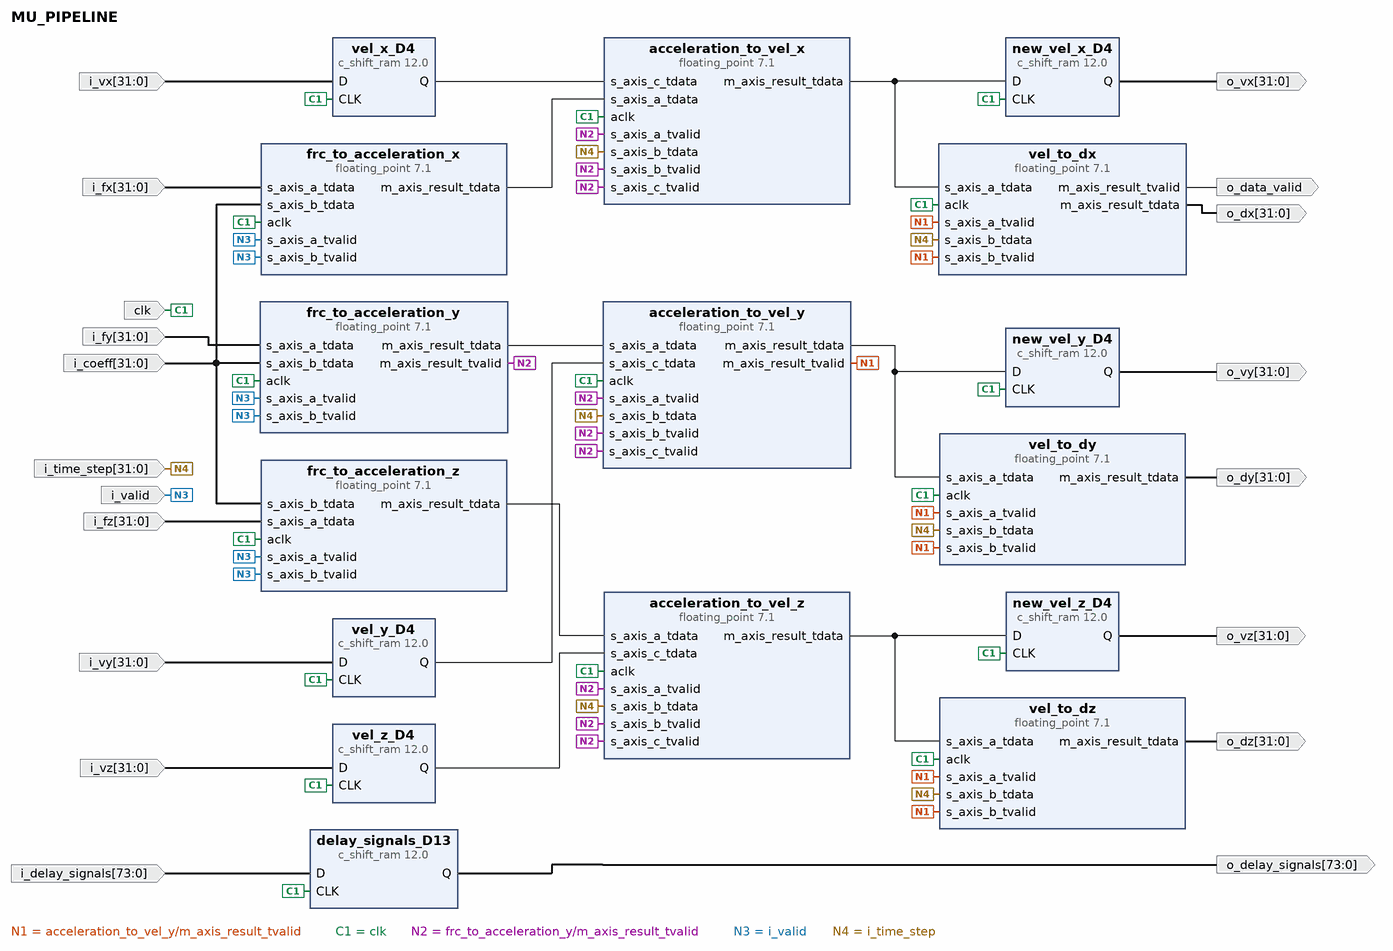
[diagram p0: block diagram of the top level]
# Vivado block design MU_PIPELINE, xcu280-fsvh2892-2L-e, Vivado 2021.2
create_bd_design MU_PIPELINE

create_bd_port -dir I -type clk clk
set_property -dict {CONFIG.FREQ_HZ 10000000} [get_bd_ports clk]
create_bd_port -dir I -from 31 -to 0 i_coeff
create_bd_port -dir I -from 73 -to 0 -type data i_delay_signals
create_bd_port -dir I -from 31 -to 0 i_fx
create_bd_port -dir I -from 31 -to 0 i_fy
create_bd_port -dir I -from 31 -to 0 i_fz
create_bd_port -dir I -from 31 -to 0 i_time_step
create_bd_port -dir I i_valid
create_bd_port -dir I -from 31 -to 0 -type data i_vx
create_bd_port -dir I -from 31 -to 0 -type data i_vy
create_bd_port -dir I -from 31 -to 0 -type data i_vz
create_bd_port -dir O o_data_valid
create_bd_port -dir O -from 73 -to 0 -type data o_delay_signals
create_bd_port -dir O -from 31 -to 0 o_dx
create_bd_port -dir O -from 31 -to 0 o_dy
create_bd_port -dir O -from 31 -to 0 o_dz
create_bd_port -dir O -from 31 -to 0 -type data o_vx
create_bd_port -dir O -from 31 -to 0 -type data o_vy
create_bd_port -dir O -from 31 -to 0 -type data o_vz

create_bd_cell -type ip -vlnv xilinx.com:ip:floating_point:7.1 acceleration_to_vel_x
set_property -dict [list \
  CONFIG.Add_Sub_Value Add \
  CONFIG.C_Latency 5 \
  CONFIG.C_Mult_Usage Medium_Usage \
  CONFIG.C_Rate 1 \
  CONFIG.C_Result_Exponent_Width 8 \
  CONFIG.C_Result_Fraction_Width 24 \
  CONFIG.Flow_Control NonBlocking \
  CONFIG.Has_RESULT_TREADY false \
  CONFIG.Maximum_Latency false \
  CONFIG.Operation_Type FMA \
  CONFIG.Result_Precision_Type Single \
] [get_bd_cells acceleration_to_vel_x]
create_bd_cell -type ip -vlnv xilinx.com:ip:floating_point:7.1 acceleration_to_vel_y
set_property -dict [list \
  CONFIG.Add_Sub_Value Add \
  CONFIG.C_Latency 5 \
  CONFIG.C_Mult_Usage Medium_Usage \
  CONFIG.C_Rate 1 \
  CONFIG.C_Result_Exponent_Width 8 \
  CONFIG.C_Result_Fraction_Width 24 \
  CONFIG.Flow_Control NonBlocking \
  CONFIG.Has_RESULT_TREADY false \
  CONFIG.Maximum_Latency false \
  CONFIG.Operation_Type FMA \
  CONFIG.Result_Precision_Type Single \
] [get_bd_cells acceleration_to_vel_y]
create_bd_cell -type ip -vlnv xilinx.com:ip:floating_point:7.1 acceleration_to_vel_z
set_property -dict [list \
  CONFIG.Add_Sub_Value Add \
  CONFIG.C_Latency 5 \
  CONFIG.C_Mult_Usage Medium_Usage \
  CONFIG.C_Rate 1 \
  CONFIG.C_Result_Exponent_Width 8 \
  CONFIG.C_Result_Fraction_Width 24 \
  CONFIG.Flow_Control NonBlocking \
  CONFIG.Has_RESULT_TREADY false \
  CONFIG.Maximum_Latency false \
  CONFIG.Operation_Type FMA \
  CONFIG.Result_Precision_Type Single \
] [get_bd_cells acceleration_to_vel_z]
create_bd_cell -type ip -vlnv xilinx.com:ip:c_shift_ram:12.0 delay_signals_D13
set_property -dict [list \
  CONFIG.AsyncInitVal 00000000000000000000000000000000000000000000000000000000000000000000000000 \
  CONFIG.DefaultData 00000000000000000000000000000000000000000000000000000000000000000000000000 \
  CONFIG.Depth 13 \
  CONFIG.Width 74 \
] [get_bd_cells delay_signals_D13]
create_bd_cell -type ip -vlnv xilinx.com:ip:floating_point:7.1 frc_to_acceleration_x
set_property -dict [list \
  CONFIG.C_Latency 4 \
  CONFIG.C_Mult_Usage Full_Usage \
  CONFIG.C_Rate 1 \
  CONFIG.C_Result_Exponent_Width 8 \
  CONFIG.C_Result_Fraction_Width 24 \
  CONFIG.Flow_Control NonBlocking \
  CONFIG.Has_RESULT_TREADY false \
  CONFIG.Maximum_Latency false \
  CONFIG.Operation_Type Multiply \
  CONFIG.Result_Precision_Type Single \
] [get_bd_cells frc_to_acceleration_x]
create_bd_cell -type ip -vlnv xilinx.com:ip:floating_point:7.1 frc_to_acceleration_y
set_property -dict [list \
  CONFIG.C_Latency 4 \
  CONFIG.C_Mult_Usage Full_Usage \
  CONFIG.C_Rate 1 \
  CONFIG.C_Result_Exponent_Width 8 \
  CONFIG.C_Result_Fraction_Width 24 \
  CONFIG.Flow_Control NonBlocking \
  CONFIG.Has_RESULT_TREADY false \
  CONFIG.Maximum_Latency false \
  CONFIG.Operation_Type Multiply \
  CONFIG.Result_Precision_Type Single \
] [get_bd_cells frc_to_acceleration_y]
create_bd_cell -type ip -vlnv xilinx.com:ip:floating_point:7.1 frc_to_acceleration_z
set_property -dict [list \
  CONFIG.C_Latency 4 \
  CONFIG.C_Mult_Usage Full_Usage \
  CONFIG.C_Rate 1 \
  CONFIG.C_Result_Exponent_Width 8 \
  CONFIG.C_Result_Fraction_Width 24 \
  CONFIG.Flow_Control NonBlocking \
  CONFIG.Has_RESULT_TREADY false \
  CONFIG.Maximum_Latency false \
  CONFIG.Operation_Type Multiply \
  CONFIG.Result_Precision_Type Single \
] [get_bd_cells frc_to_acceleration_z]
create_bd_cell -type ip -vlnv xilinx.com:ip:c_shift_ram:12.0 new_vel_x_D4
set_property -dict {CONFIG.Depth 4 CONFIG.Width 32} [get_bd_cells new_vel_x_D4]
create_bd_cell -type ip -vlnv xilinx.com:ip:c_shift_ram:12.0 new_vel_y_D4
set_property -dict {CONFIG.Depth 4 CONFIG.Width 32} [get_bd_cells new_vel_y_D4]
create_bd_cell -type ip -vlnv xilinx.com:ip:c_shift_ram:12.0 new_vel_z_D4
set_property -dict {CONFIG.Depth 4 CONFIG.Width 32} [get_bd_cells new_vel_z_D4]
create_bd_cell -type ip -vlnv xilinx.com:ip:floating_point:7.1 vel_to_dx
set_property -dict [list \
  CONFIG.Add_Sub_Value Both \
  CONFIG.C_Latency 4 \
  CONFIG.C_Mult_Usage Medium_Usage \
  CONFIG.C_Rate 1 \
  CONFIG.C_Result_Exponent_Width 8 \
  CONFIG.C_Result_Fraction_Width 24 \
  CONFIG.Flow_Control NonBlocking \
  CONFIG.Has_RESULT_TREADY false \
  CONFIG.Maximum_Latency false \
  CONFIG.Operation_Type Multiply \
  CONFIG.Result_Precision_Type Single \
] [get_bd_cells vel_to_dx]
create_bd_cell -type ip -vlnv xilinx.com:ip:floating_point:7.1 vel_to_dy
set_property -dict [list \
  CONFIG.Add_Sub_Value Both \
  CONFIG.C_Latency 4 \
  CONFIG.C_Mult_Usage Medium_Usage \
  CONFIG.C_Rate 1 \
  CONFIG.C_Result_Exponent_Width 8 \
  CONFIG.C_Result_Fraction_Width 24 \
  CONFIG.Flow_Control NonBlocking \
  CONFIG.Has_RESULT_TREADY false \
  CONFIG.Maximum_Latency false \
  CONFIG.Operation_Type Multiply \
  CONFIG.Result_Precision_Type Single \
] [get_bd_cells vel_to_dy]
create_bd_cell -type ip -vlnv xilinx.com:ip:floating_point:7.1 vel_to_dz
set_property -dict [list \
  CONFIG.Add_Sub_Value Both \
  CONFIG.C_Latency 4 \
  CONFIG.C_Mult_Usage Medium_Usage \
  CONFIG.C_Rate 1 \
  CONFIG.C_Result_Exponent_Width 8 \
  CONFIG.C_Result_Fraction_Width 24 \
  CONFIG.Flow_Control NonBlocking \
  CONFIG.Has_RESULT_TREADY false \
  CONFIG.Maximum_Latency false \
  CONFIG.Operation_Type Multiply \
  CONFIG.Result_Precision_Type Single \
] [get_bd_cells vel_to_dz]
create_bd_cell -type ip -vlnv xilinx.com:ip:c_shift_ram:12.0 vel_x_D4
set_property -dict {CONFIG.Depth 4 CONFIG.Width 32} [get_bd_cells vel_x_D4]
create_bd_cell -type ip -vlnv xilinx.com:ip:c_shift_ram:12.0 vel_y_D4
set_property -dict {CONFIG.Depth 4 CONFIG.Width 32} [get_bd_cells vel_y_D4]
create_bd_cell -type ip -vlnv xilinx.com:ip:c_shift_ram:12.0 vel_z_D4
set_property -dict {CONFIG.Depth 4 CONFIG.Width 32} [get_bd_cells vel_z_D4]

# ---- connections ----

connect_bd_net -net D_0_1 [get_bd_ports i_vx] [get_bd_pins vel_x_D4/D]
connect_bd_net -net D_0_2 [get_bd_ports i_delay_signals] [get_bd_pins delay_signals_D13/D]
connect_bd_net -net D_1_1 [get_bd_ports i_vz] [get_bd_pins vel_z_D4/D]
connect_bd_net -net D_2_1 [get_bd_ports i_vy] [get_bd_pins vel_y_D4/D]
connect_bd_net [get_bd_pins acceleration_to_vel_x/m_axis_result_tdata] [get_bd_pins new_vel_x_D4/D] [get_bd_pins vel_to_dx/s_axis_a_tdata]
connect_bd_net [get_bd_pins acceleration_to_vel_y/m_axis_result_tdata] [get_bd_pins new_vel_y_D4/D] [get_bd_pins vel_to_dy/s_axis_a_tdata]
connect_bd_net [get_bd_pins acceleration_to_vel_y/m_axis_result_tvalid] \
  [get_bd_pins vel_to_dx/s_axis_a_tvalid] [get_bd_pins vel_to_dx/s_axis_b_tvalid] [get_bd_pins vel_to_dy/s_axis_a_tvalid] \
  [get_bd_pins vel_to_dy/s_axis_b_tvalid] [get_bd_pins vel_to_dz/s_axis_a_tvalid] [get_bd_pins vel_to_dz/s_axis_b_tvalid]
connect_bd_net [get_bd_pins acceleration_to_vel_z/m_axis_result_tdata] [get_bd_pins new_vel_z_D4/D] [get_bd_pins vel_to_dz/s_axis_a_tdata]
connect_bd_net -net aclk_0_1 [get_bd_ports clk] \
  [get_bd_pins acceleration_to_vel_x/aclk] [get_bd_pins acceleration_to_vel_y/aclk] [get_bd_pins acceleration_to_vel_z/aclk] \
  [get_bd_pins delay_signals_D13/CLK] [get_bd_pins frc_to_acceleration_x/aclk] [get_bd_pins frc_to_acceleration_y/aclk] \
  [get_bd_pins frc_to_acceleration_z/aclk] [get_bd_pins new_vel_x_D4/CLK] [get_bd_pins new_vel_y_D4/CLK] \
  [get_bd_pins new_vel_z_D4/CLK] [get_bd_pins vel_to_dx/aclk] [get_bd_pins vel_to_dy/aclk] [get_bd_pins vel_to_dz/aclk] \
  [get_bd_pins vel_x_D4/CLK] [get_bd_pins vel_y_D4/CLK] [get_bd_pins vel_z_D4/CLK]
connect_bd_net [get_bd_pins delay_signals_D13/Q] [get_bd_ports o_delay_signals]
connect_bd_net [get_bd_pins frc_to_acceleration_x/m_axis_result_tdata] [get_bd_pins acceleration_to_vel_x/s_axis_a_tdata]
connect_bd_net [get_bd_pins frc_to_acceleration_y/m_axis_result_tdata] [get_bd_pins acceleration_to_vel_y/s_axis_a_tdata]
connect_bd_net [get_bd_pins frc_to_acceleration_y/m_axis_result_tvalid] \
  [get_bd_pins acceleration_to_vel_x/s_axis_a_tvalid] [get_bd_pins acceleration_to_vel_x/s_axis_b_tvalid] \
  [get_bd_pins acceleration_to_vel_x/s_axis_c_tvalid] [get_bd_pins acceleration_to_vel_y/s_axis_a_tvalid] \
  [get_bd_pins acceleration_to_vel_y/s_axis_b_tvalid] [get_bd_pins acceleration_to_vel_y/s_axis_c_tvalid] \
  [get_bd_pins acceleration_to_vel_z/s_axis_a_tvalid] [get_bd_pins acceleration_to_vel_z/s_axis_b_tvalid] \
  [get_bd_pins acceleration_to_vel_z/s_axis_c_tvalid]
connect_bd_net [get_bd_pins frc_to_acceleration_z/m_axis_result_tdata] [get_bd_pins acceleration_to_vel_z/s_axis_a_tdata]
connect_bd_net [get_bd_pins new_vel_x_D4/Q] [get_bd_ports o_vx]
connect_bd_net [get_bd_pins new_vel_y_D4/Q] [get_bd_ports o_vy]
connect_bd_net [get_bd_pins new_vel_z_D4/Q] [get_bd_ports o_vz]
connect_bd_net -net s_axis_a_tdata_0_1 [get_bd_ports i_fz] [get_bd_pins frc_to_acceleration_z/s_axis_a_tdata]
connect_bd_net -net s_axis_a_tdata_1_1 [get_bd_ports i_fy] [get_bd_pins frc_to_acceleration_y/s_axis_a_tdata]
connect_bd_net -net s_axis_a_tdata_2_1 [get_bd_ports i_fx] [get_bd_pins frc_to_acceleration_x/s_axis_a_tdata]
connect_bd_net -net s_axis_a_tvalid_0_1 [get_bd_ports i_valid] \
  [get_bd_pins frc_to_acceleration_x/s_axis_a_tvalid] [get_bd_pins frc_to_acceleration_x/s_axis_b_tvalid] \
  [get_bd_pins frc_to_acceleration_y/s_axis_a_tvalid] [get_bd_pins frc_to_acceleration_y/s_axis_b_tvalid] \
  [get_bd_pins frc_to_acceleration_z/s_axis_a_tvalid] [get_bd_pins frc_to_acceleration_z/s_axis_b_tvalid]
connect_bd_net -net s_axis_b_tdata_0_1 [get_bd_ports i_time_step] \
  [get_bd_pins acceleration_to_vel_x/s_axis_b_tdata] [get_bd_pins acceleration_to_vel_y/s_axis_b_tdata] \
  [get_bd_pins acceleration_to_vel_z/s_axis_b_tdata] [get_bd_pins vel_to_dx/s_axis_b_tdata] \
  [get_bd_pins vel_to_dy/s_axis_b_tdata] [get_bd_pins vel_to_dz/s_axis_b_tdata]
connect_bd_net -net s_axis_b_tdata_1_1 [get_bd_ports i_coeff] \
  [get_bd_pins frc_to_acceleration_x/s_axis_b_tdata] [get_bd_pins frc_to_acceleration_y/s_axis_b_tdata] \
  [get_bd_pins frc_to_acceleration_z/s_axis_b_tdata]
connect_bd_net -net vel_to_pos_x_m_axis_result_tdata [get_bd_pins vel_to_dx/m_axis_result_tdata] [get_bd_ports o_dx]
connect_bd_net -net vel_to_pos_x_m_axis_result_tvalid [get_bd_pins vel_to_dx/m_axis_result_tvalid] [get_bd_ports o_data_valid]
connect_bd_net -net vel_to_pos_y_m_axis_result_tdata [get_bd_pins vel_to_dy/m_axis_result_tdata] [get_bd_ports o_dy]
connect_bd_net -net vel_to_pos_z_m_axis_result_tdata [get_bd_pins vel_to_dz/m_axis_result_tdata] [get_bd_ports o_dz]
connect_bd_net -net vel_x_D3_Q [get_bd_pins vel_x_D4/Q] [get_bd_pins acceleration_to_vel_x/s_axis_c_tdata]
connect_bd_net -net vel_y_D3_Q [get_bd_pins vel_y_D4/Q] [get_bd_pins acceleration_to_vel_y/s_axis_c_tdata]
connect_bd_net -net vel_z_D3_Q [get_bd_pins vel_z_D4/Q] [get_bd_pins acceleration_to_vel_z/s_axis_c_tdata]

validate_bd_design
save_bd_design
